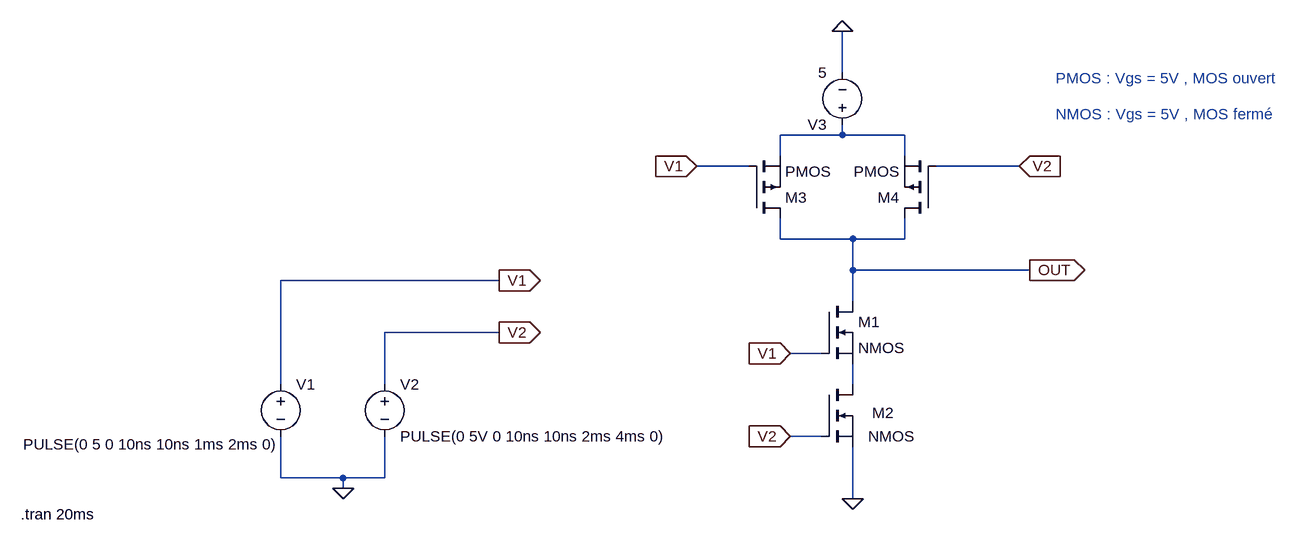
[diagram p0: schematic NAND.asc]
NAND.asc, the LTspice schematic file:
Version 4
SHEET 1 1276 680
WIRE 592 -208 592 -272
WIRE 592 -112 592 -128
WIRE 592 -112 496 -112
WIRE 688 -112 592 -112
WIRE 496 -80 496 -112
WIRE 688 -80 688 -112
WIRE 448 -64 368 -64
WIRE 864 -64 736 -64
WIRE 496 48 496 16
WIRE 608 48 496 48
WIRE 688 48 688 16
WIRE 688 48 608 48
WIRE 608 96 608 48
WIRE 880 96 608 96
WIRE 64 112 -272 112
WIRE 608 144 608 96
WIRE 64 192 -112 192
WIRE 560 224 512 224
WIRE -272 272 -272 112
WIRE -112 272 -112 192
WIRE 608 272 608 240
WIRE 560 352 512 352
WIRE -272 416 -272 352
WIRE -176 416 -272 416
WIRE -112 416 -112 352
WIRE -112 416 -176 416
WIRE -176 432 -176 416
WIRE 608 448 608 368
FLAG 64 112 V1
IOPIN 64 112 Out
FLAG 64 192 V2
IOPIN 64 192 Out
FLAG 368 -64 V1
IOPIN 368 -64 In
FLAG 864 -64 V2
IOPIN 864 -64 In
FLAG 512 224 V1
IOPIN 512 224 In
FLAG 512 352 V2
IOPIN 512 352 In
FLAG 880 96 OUT
IOPIN 880 96 Out
FLAG 608 448 0
FLAG 592 -272 0
FLAG -176 432 0
SYMBOL nmos 560 144 R0
SYMATTR InstName M1
SYMBOL nmos 560 272 R0
WINDOW 0 78 44 Left 2
WINDOW 3 72 80 Left 2
SYMATTR InstName M2
SYMBOL pmos 448 16 M180
SYMATTR InstName M3
SYMBOL pmos 736 16 R180
SYMATTR InstName M4
SYMBOL voltage -272 256 R0
WINDOW 3 -396 108 Left 2
WINDOW 123 0 0 Left 0
WINDOW 39 0 0 Left 0
SYMATTR Value PULSE(0 5 0 10ns 10ns 1ms 2ms 0)
SYMATTR InstName V1
SYMBOL voltage -112 256 R0
WINDOW 123 0 0 Left 0
WINDOW 39 0 0 Left 0
SYMATTR InstName V2
SYMATTR Value PULSE(0 5V 0 10ns 10ns 2ms 4ms 0)
SYMBOL voltage 592 -112 R180
WINDOW 123 0 0 Left 0
WINDOW 39 0 0 Left 0
SYMATTR InstName V3
SYMATTR Value 5
TEXT -672 472 Left 2 !.tran 20ms
TEXT 920 -200 Left 2 ;PMOS : Vgs = 5V , MOS ouvert
TEXT 920 -144 Left 2 ;NMOS : Vgs = 5V , MOS fermé

The netlist it stands for:
* NAND.asc
M1 OUT V1 N002 N002 NMOS
M2 N002 V2 0 0 NMOS
M3 OUT V1 N001 N001 PMOS
M4 OUT V2 N001 N001 PMOS
V1 V1 0 PULSE(0 5 0 10ns 10ns 1ms 2ms 0)
V2 V2 0 PULSE(0 5V 0 10ns 10ns 2ms 4ms 0)
V3 N001 0 5
.model NMOS NMOS
.model PMOS PMOS
.lib standard.mos
.tran 20ms
* PMOS : Vgs = 5V , MOS ouvert
* NMOS : Vgs = 5V , MOS fermé
.backanno
.end